# Altium schematic sheet LED.SchDoc: LED Cube 8x8x8 - LED
size A4; Author: Luka Penger; CompanyName: L. Penger; DrawnBy: Luka Penger; Organization: L. Penger; Address1: Luka Penger; Address2: http://lukapenger.eu; Address3: Software & Hardware; Address4: Development; DocumentNumber: 3; Revision: 2.0.0; SheetNumber: 3; SheetTotal: 4; DocumentName: LED; ProjectName: LED Cube 8x8x8
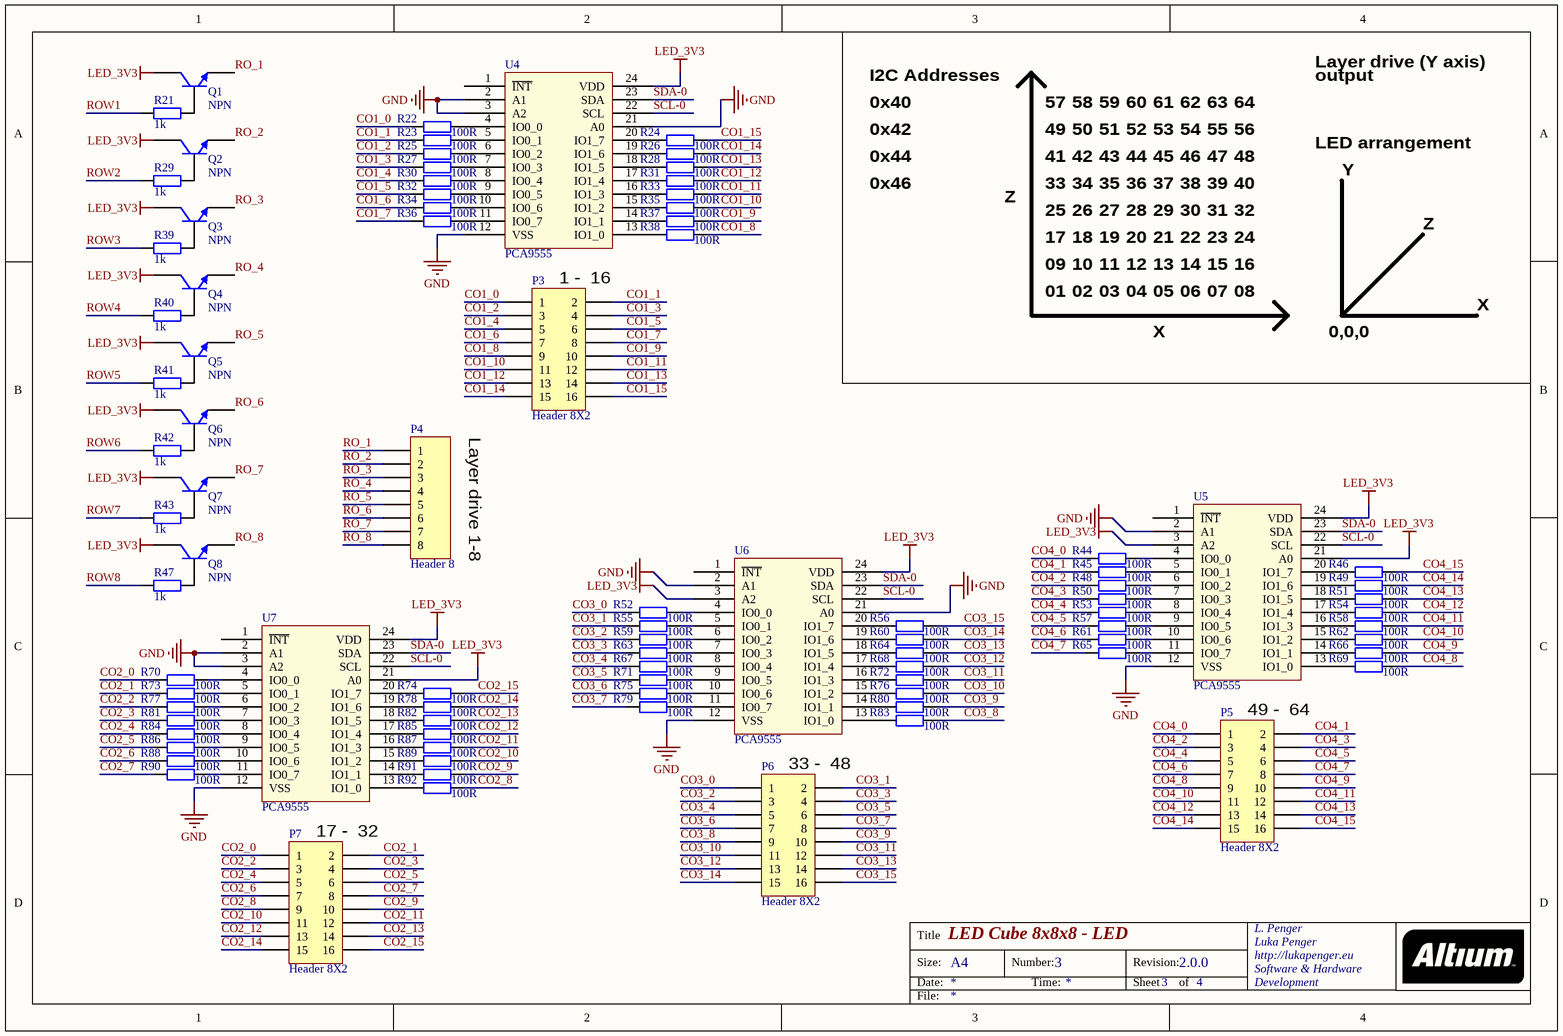
[diagram p0: LED.SchDoc]

## Parts
P3  Header 8X2  [IDC-2x8]
P4  Header 8  [IDC-2x4]
P5  Header 8X2  [IDC-2x8]
P6  Header 8X2  [IDC-2x8]
P7  Header 8X2  [IDC-2x8]
Q1  NPN  [SOT89N]
Q2  NPN  [SOT89N]
Q3  NPN  [SOT89N]
Q4  NPN  [SOT89N]
Q5  NPN  [SOT89N]
Q6  NPN  [SOT89N]
Q7  NPN  [SOT89N]
Q8  NPN  [SOT89N]
R21  1k  [6-0805_N]
R22  100R  [6-0805_N]
R23  100R  [6-0805_N]
R24  100R  [6-0805_N]
R25  100R  [6-0805_N]
R26  100R  [6-0805_N]
R27  100R  [6-0805_N]
R28  100R  [6-0805_N]
R29  1k  [6-0805_N]
R30  100R  [6-0805_N]
R31  100R  [6-0805_N]
R32  100R  [6-0805_N]
R33  100R  [6-0805_N]
R34  100R  [6-0805_N]
R35  100R  [6-0805_N]
R36  100R  [6-0805_N]
R37  100R  [6-0805_N]
R38  100R  [6-0805_N]
R39  1k  [6-0805_N]
R40  1k  [6-0805_N]
R41  1k  [6-0805_N]
R42  1k  [6-0805_N]
R43  1k  [6-0805_N]
R44  100R  [6-0805_N]
R45  100R  [6-0805_N]
R46  100R  [6-0805_N]
R47  1k  [6-0805_N]
R48  100R  [6-0805_N]
R49  100R  [6-0805_N]
R50  100R  [6-0805_N]
R51  100R  [6-0805_N]
R52  100R  [6-0805_N]
R53  100R  [6-0805_N]
R54  100R  [6-0805_N]
R55  100R  [6-0805_N]
R56  100R  [6-0805_N]
R57  100R  [6-0805_N]
R58  100R  [6-0805_N]
R59  100R  [6-0805_N]
R60  100R  [6-0805_N]
R61  100R  [6-0805_N]
R62  100R  [6-0805_N]
R63  100R  [6-0805_N]
R64  100R  [6-0805_N]
R65  100R  [6-0805_N]
R66  100R  [6-0805_N]
R67  100R  [6-0805_N]
R68  100R  [6-0805_N]
R69  100R  [6-0805_N]
R70  100R  [6-0805_N]
R71  100R  [6-0805_N]
R72  100R  [6-0805_N]
R73  100R  [6-0805_N]
R74  100R  [6-0805_N]
R75  100R  [6-0805_N]
R76  100R  [6-0805_N]
R77  100R  [6-0805_N]
R78  100R  [6-0805_N]
R79  100R  [6-0805_N]
R80  100R  [6-0805_N]
R81  100R  [6-0805_N]
R82  100R  [6-0805_N]
R83  100R  [6-0805_N]
R84  100R  [6-0805_N]
R85  100R  [6-0805_N]
R86  100R  [6-0805_N]
R87  100R  [6-0805_N]
R88  100R  [6-0805_N]
R89  100R  [6-0805_N]
R90  100R  [6-0805_N]
R91  100R  [6-0805_N]
R92  100R  [6-0805_N]
U4  PCA9555  [SSOP24_N]
U5  PCA9555  [SSOP24_N]
U6  PCA9555  [SSOP24_N]
U7  PCA9555  [SSOP24_N]

## Nets
GND: U4.2(A1) U4.3(A2) U4.12(VSS) U4.21(A0) U5.2(A1) U5.12(VSS) U6.2(A1) U6.12(VSS) U6.21(A0) U7.2(A1) U7.3(A2) U7.12(VSS)
LED_3V3: Q1.1(C) Q2.1(C) Q3.1(C) Q4.1(C) Q5.1(C) Q6.1(C) Q7.1(C) Q8.1(C) U4.24(VDD) U5.3(A2) U5.21(A0) U5.24(VDD) U6.3(A2) U6.24(VDD) U7.21(A0) U7.24(VDD)
CO1_0: P3.1 R22.1
CO1_1: P3.2 R23.1
CO1_2: P3.3 R25.1
CO1_3: P3.4 R27.1
CO1_4: P3.5 R30.1
CO1_5: P3.6 R32.1
CO1_6: P3.7 R34.1
CO1_7: P3.8 R36.1
CO1_8: P3.9 R38.2
CO1_9: P3.10 R37.2
CO1_10: P3.11 R35.2
CO1_11: P3.12 R33.2
CO1_12: P3.13 R31.2
CO1_13: P3.14 R28.2
CO1_14: P3.15 R26.2
CO1_15: P3.16 R24.2
CO2_0: P7.1 R70.1
CO2_1: P7.2 R73.1
CO2_2: P7.3 R77.1
CO2_3: P7.4 R81.1
CO2_4: P7.5 R84.1
CO2_5: P7.6 R86.1
CO2_6: P7.7 R88.1
CO2_7: P7.8 R90.1
CO2_8: P7.9 R92.2
CO2_9: P7.10 R91.2
CO2_10: P7.11 R89.2
CO2_11: P7.12 R87.2
CO2_12: P7.13 R85.2
CO2_13: P7.14 R82.2
CO2_14: P7.15 R78.2
CO2_15: P7.16 R74.2
CO3_0: P6.1 R52.1
CO3_1: P6.2 R55.1
CO3_2: P6.3 R59.1
CO3_3: P6.4 R63.1
CO3_4: P6.5 R67.1
CO3_5: P6.6 R71.1
CO3_6: P6.7 R75.1
CO3_7: P6.8 R79.1
CO3_8: P6.9 R83.2
CO3_9: P6.10 R80.2
CO3_10: P6.11 R76.2
CO3_11: P6.12 R72.2
CO3_12: P6.13 R68.2
CO3_13: P6.14 R64.2
CO3_14: P6.15 R60.2
CO3_15: P6.16 R56.2
CO4_0: P5.1 R44.1
CO4_1: P5.2 R45.1
CO4_2: P5.3 R48.1
CO4_3: P5.4 R50.1
CO4_4: P5.5 R53.1
CO4_5: P5.6 R57.1
CO4_6: P5.7 R61.1
CO4_7: P5.8 R65.1
CO4_8: P5.9 R69.2
CO4_9: P5.10 R66.2
CO4_10: P5.11 R62.2
CO4_11: P5.12 R58.2
CO4_12: P5.13 R54.2
CO4_13: P5.14 R51.2
CO4_14: P5.15 R49.2
CO4_15: P5.16 R46.2
RO_1: P4.1 Q1.3(E)
RO_2: P4.2 Q2.3(E)
RO_3: P4.3 Q3.3(E)
RO_4: P4.4 Q4.3(E)
RO_5: P4.5 Q5.3(E)
RO_6: P4.6 Q6.3(E)
RO_7: P4.7 Q7.3(E)
RO_8: P4.8 Q8.3(E)
ROW1: R21.2
ROW2: R29.2
ROW3: R39.2
ROW4: R40.2
ROW5: R41.2
ROW6: R42.2
ROW7: R43.2
ROW8: R47.2
SCL-0: U4.22(SCL) U5.22(SCL) U6.22(SCL) U7.22(SCL)
SDA-0: U4.23(SDA) U5.23(SDA) U6.23(SDA) U7.23(SDA)
NetQ1_2: Q1.2(B) R21.1
NetQ2_2: Q2.2(B) R29.1
NetQ3_2: Q3.2(B) R39.1
NetQ4_2: Q4.2(B) R40.1
NetQ5_2: Q5.2(B) R41.1
NetQ6_2: Q6.2(B) R42.1
NetQ7_2: Q7.2(B) R43.1
NetQ8_2: Q8.2(B) R47.1
NetR22_2: R22.2 U4.4(IO0_0)
NetR23_2: R23.2 U4.5(IO0_1)
NetR24_1: R24.1 U4.20(IO1_7)
NetR25_2: R25.2 U4.6(IO0_2)
NetR26_1: R26.1 U4.19(IO1_6)
NetR27_2: R27.2 U4.7(IO0_3)
NetR28_1: R28.1 U4.18(IO1_5)
NetR30_2: R30.2 U4.8(IO0_4)
NetR31_1: R31.1 U4.17(IO1_4)
NetR32_2: R32.2 U4.9(IO0_5)
NetR33_1: R33.1 U4.16(IO1_3)
NetR34_2: R34.2 U4.10(IO0_6)
NetR35_1: R35.1 U4.15(IO1_2)
NetR36_2: R36.2 U4.11(IO0_7)
NetR37_1: R37.1 U4.14(IO1_1)
NetR38_1: R38.1 U4.13(IO1_0)
NetR44_2: R44.2 U5.4(IO0_0)
NetR45_2: R45.2 U5.5(IO0_1)
NetR46_1: R46.1 U5.20(IO1_7)
NetR48_2: R48.2 U5.6(IO0_2)
NetR49_1: R49.1 U5.19(IO1_6)
NetR50_2: R50.2 U5.7(IO0_3)
NetR51_1: R51.1 U5.18(IO1_5)
NetR52_2: R52.2 U6.4(IO0_0)
NetR53_2: R53.2 U5.8(IO0_4)
NetR54_1: R54.1 U5.17(IO1_4)
NetR55_2: R55.2 U6.5(IO0_1)
NetR56_1: R56.1 U6.20(IO1_7)
NetR57_2: R57.2 U5.9(IO0_5)
NetR58_1: R58.1 U5.16(IO1_3)
NetR59_2: R59.2 U6.6(IO0_2)
NetR60_1: R60.1 U6.19(IO1_6)
NetR61_2: R61.2 U5.10(IO0_6)
NetR62_1: R62.1 U5.15(IO1_2)
NetR63_2: R63.2 U6.7(IO0_3)
NetR64_1: R64.1 U6.18(IO1_5)
NetR65_2: R65.2 U5.11(IO0_7)
NetR66_1: R66.1 U5.14(IO1_1)
NetR67_2: R67.2 U6.8(IO0_4)
NetR68_1: R68.1 U6.17(IO1_4)
NetR69_1: R69.1 U5.13(IO1_0)
NetR70_2: R70.2 U7.4(IO0_0)
NetR71_2: R71.2 U6.9(IO0_5)
NetR72_1: R72.1 U6.16(IO1_3)
NetR73_2: R73.2 U7.5(IO0_1)
NetR74_1: R74.1 U7.20(IO1_7)
NetR75_2: R75.2 U6.10(IO0_6)
NetR76_1: R76.1 U6.15(IO1_2)
NetR77_2: R77.2 U7.6(IO0_2)
NetR78_1: R78.1 U7.19(IO1_6)
NetR79_2: R79.2 U6.11(IO0_7)
NetR80_1: R80.1 U6.14(IO1_1)
NetR81_2: R81.2 U7.7(IO0_3)
NetR82_1: R82.1 U7.18(IO1_5)
NetR83_1: R83.1 U6.13(IO1_0)
NetR84_2: R84.2 U7.8(IO0_4)
NetR85_1: R85.1 U7.17(IO1_4)
NetR86_2: R86.2 U7.9(IO0_5)
NetR87_1: R87.1 U7.16(IO1_3)
NetR88_2: R88.2 U7.10(IO0_6)
NetR89_1: R89.1 U7.15(IO1_2)
NetR90_2: R90.2 U7.11(IO0_7)
NetR91_1: R91.1 U7.14(IO1_1)
NetR92_1: R92.1 U7.13(IO1_0)

Not connected (* = marked no-connect by the designer): U4 1(~{INT}); U5 1(~{INT}); U6 1(~{INT}); U7 1(~{INT})

## Notes on the sheet
- I2C Addresses
- 0x40
- 57
- 58
- 59
- 60
- 61
- 62
- 63
- 64
- Layer drive (Y axis)
- output
- 0x42
- 0x44
- 41
- 49
- 42
- 50
- 43
- 51
- 44
- 52
- 45
- 53
- 46
- 54
- 47
- 55
- 48
- 56
- LED arrangement
- Y
- 0x46
- Z
- 17
- 25
- 33
- 18
- 26
- 34
- 19
- 27
- 35
- 20
- 28
- 36
- 21
- 29
- 37
- 22
- 30
- 38
- 23
- 31
- 39
- 24
- 32
- 40
- (near P3) 1 -  16
- 01
- 09
- 02
- 10
- 03
- 11
- 04
- 12
- 05
- 13
- 06
- 14
- 07
- 15
- 08
- 16
- X
- 0,0,0
- Layer drive 1-8
- (near P5) 49 -  64
- (near P6) 33 -  48
- (near P7) 17 -  32
- Title
- Size:
- Date:
- A4
- Number:
- Time:
- Revision:
- Sheet
- of
- File:

## Library data of the parts
P3 P5-P7 = Header 8X2: Header, 8-Pin, Dual row; LatestRevisionDate: 17-Jul-2002; LatestRevisionNote: Re-released for DXP Platform.; Publisher: Altium Limited
P4 = Header 8: Header, 8-Pin; LatestRevisionDate: 17-Jul-2002; LatestRevisionNote: Re-released for DXP Platform.; Publisher: Altium Limited
Q1-Q8 = NPN: NPN Bipolar Transistor; Published: 8-Jun-2000; LatestRevisionDate: 17-Jul-2002; LatestRevisionNote: Re-released for DXP Platform.; PackageReference: TO-226-AA; Publisher: Altium Limited; PackageDescription: TO, Flat Index; 3 In-Line, Axial Leads; Body Dia. 4.8mm; Leads 0.55 x 0.51 mm (max); Code_JEDEC: TO-226-AA
R21 R29 R39-R43 R47 = Res2: Resistor; Published: 8-Jun-2000; LatestRevisionDate: 17-Jul-2002; LatestRevisionNote: Re-released for DXP Platform.; PackageReference: AXIAL-0.4; Publisher: Altium Limited; PackageDescription: Axial Device, Thru-Hole; 2 Leads; 0.4 in Pin Spacing; Value: 1K
R22-R28 R30-R38 R44-R46 R48-R92 = Res2: Resistor; Value: 1K; Published: 8-Jun-2000; LatestRevisionDate: 17-Jul-2002; LatestRevisionNote: Re-released for DXP Platform.; PackageReference: AXIAL-0.4; Publisher: Altium Limited; PackageDescription: Axial Device, Thru-Hole; 2 Leads; 0.4 in Pin Spacing
U4-U7 = PCA9555: I2C I/O Ports